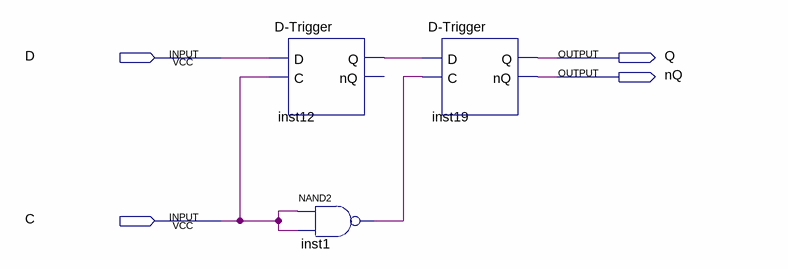
[diagram p0: schematic sheet]
// Quartus schematic D-TriggerWithRisingEdge.bdf as structural Verilog: 3 symbols, 4 pins
module \D-TriggerWithRisingEdge  (
  input  D,
  input  C,
  output Q,
  output nQ
);

  wire inst1_out, inst12_q;

  \D-Trigger  inst12 (.D(D), .C(C), .Q(inst12_q));  // open: nQ
  nand inst1 (inst1_out, C, C);
  \D-Trigger  inst19 (.D(inst12_q), .C(inst1_out), .Q(Q), .nQ(nQ));
endmodule
